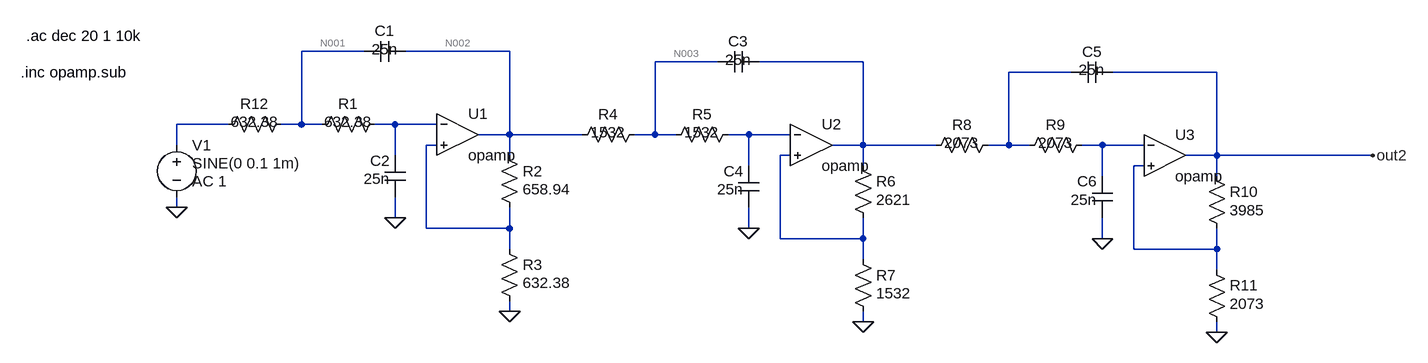
[diagram p0: schematic Draft2.asc]
Draft2.asc, the LTspice schematic file:
Version 4
SHEET 1 1080 680
WIRE -544 -48 -640 -48
WIRE -320 -48 -480 -48
WIRE 0 -32 -96 -32
WIRE 224 -32 64 -32
WIRE 544 -16 448 -16
WIRE 768 -16 608 -16
WIRE -752 64 -832 64
WIRE -640 64 -640 -48
WIRE -640 64 -672 64
WIRE -608 64 -640 64
WIRE -496 64 -528 64
WIRE -432 64 -496 64
WIRE -320 80 -320 -48
WIRE -320 80 -368 80
WIRE -208 80 -320 80
WIRE -96 80 -96 -32
WIRE -96 80 -128 80
WIRE -64 80 -96 80
WIRE 48 80 16 80
WIRE 112 80 48 80
WIRE -832 96 -832 64
WIRE -432 96 -448 96
WIRE 224 96 224 -32
WIRE 224 96 176 96
WIRE 336 96 224 96
WIRE 448 96 448 -16
WIRE 448 96 416 96
WIRE 480 96 448 96
WIRE 592 96 560 96
WIRE 656 96 592 96
WIRE -496 112 -496 64
WIRE -320 112 -320 80
WIRE 112 112 96 112
WIRE 768 112 768 -16
WIRE 768 112 720 112
WIRE 1008 112 768 112
WIRE 48 128 48 80
WIRE 224 128 224 96
WIRE 656 128 640 128
WIRE 592 144 592 96
WIRE 768 144 768 112
WIRE -832 192 -832 176
WIRE -496 208 -496 176
WIRE -448 224 -448 96
WIRE -320 224 -320 192
WIRE -320 224 -448 224
WIRE 48 224 48 192
WIRE 96 240 96 112
WIRE 224 240 224 208
WIRE 224 240 96 240
WIRE 592 240 592 208
WIRE -320 256 -320 224
WIRE 640 256 640 128
WIRE 768 256 768 224
WIRE 768 256 640 256
WIRE 224 272 224 240
WIRE 768 288 768 256
WIRE -320 352 -320 336
WIRE 224 368 224 352
WIRE 768 384 768 368
FLAG -832 192 0
FLAG -496 208 0
FLAG -320 352 0
FLAG 48 224 0
FLAG 224 368 0
FLAG 592 240 0
FLAG 768 384 0
FLAG 1008 112 out2
SYMBOL res -512 48 R90
WINDOW 0 0 56 VBottom 2
WINDOW 3 28 56 VBottom 2
SYMATTR InstName R1
SYMATTR Value 632.38
SYMBOL cap -480 -64 R90
WINDOW 0 0 32 VBottom 2
WINDOW 3 28 32 VBottom 2
SYMATTR InstName C1
SYMATTR Value 25n
SYMBOL cap -480 176 R180
WINDOW 0 24 56 Left 2
WINDOW 3 24 28 Left 2
SYMATTR InstName C2
SYMATTR Value 25n
SYMBOL OpAmps\\opamp -400 16 R0
SYMATTR InstName U1
SYMBOL res -336 96 R0
WINDOW 3 36 68 Left 2
SYMATTR Value 658.94
SYMATTR InstName R2
SYMBOL res -336 240 R0
WINDOW 3 36 68 Left 2
SYMATTR Value 632.38
SYMATTR InstName R3
SYMBOL voltage -832 80 R0
WINDOW 123 24 72 Left 2
WINDOW 39 0 0 Left 0
WINDOW 3 24 44 Left 2
SYMATTR Value2 AC 1
SYMATTR Value SINE(0 0.1 1m)
SYMATTR InstName V1
SYMBOL res -112 64 R90
WINDOW 0 0 56 VBottom 2
WINDOW 3 28 56 VBottom 2
SYMATTR InstName R4
SYMATTR Value 1532
SYMBOL res 32 64 R90
WINDOW 0 0 56 VBottom 2
WINDOW 3 28 56 VBottom 2
SYMATTR InstName R5
SYMATTR Value 1532
SYMBOL cap 64 -48 R90
WINDOW 0 0 32 VBottom 2
WINDOW 3 28 32 VBottom 2
SYMATTR InstName C3
SYMATTR Value 25n
SYMBOL cap 64 192 R180
WINDOW 0 24 56 Left 2
WINDOW 3 24 28 Left 2
SYMATTR InstName C4
SYMATTR Value 25n
SYMBOL res 208 112 R0
WINDOW 3 36 68 Left 2
SYMATTR Value 2621
SYMATTR InstName R6
SYMBOL res 208 256 R0
WINDOW 3 36 68 Left 2
SYMATTR Value 1532
SYMATTR InstName R7
SYMBOL res 432 80 R90
WINDOW 0 0 56 VBottom 2
WINDOW 3 28 56 VBottom 2
SYMATTR InstName R8
SYMATTR Value 2073
SYMBOL res 576 80 R90
WINDOW 0 0 56 VBottom 2
WINDOW 3 28 56 VBottom 2
SYMATTR InstName R9
SYMATTR Value 2073
SYMBOL cap 608 -32 R90
WINDOW 0 0 32 VBottom 2
WINDOW 3 28 32 VBottom 2
SYMATTR InstName C5
SYMATTR Value 25n
SYMBOL cap 608 208 R180
WINDOW 0 24 56 Left 2
WINDOW 3 24 28 Left 2
SYMATTR InstName C6
SYMATTR Value 25n
SYMBOL res 752 128 R0
WINDOW 3 36 68 Left 2
SYMATTR Value 3985
SYMATTR InstName R10
SYMBOL res 752 272 R0
WINDOW 3 36 68 Left 2
SYMATTR Value 2073
SYMATTR InstName R11
SYMBOL res -656 48 R90
WINDOW 0 0 56 VBottom 2
WINDOW 3 28 56 VBottom 2
SYMATTR InstName R12
SYMATTR Value 632.38
SYMBOL OpAmps\\opamp 144 32 R0
SYMATTR InstName U2
SYMBOL OpAmps\\opamp 688 48 R0
SYMATTR InstName U3
TEXT -1072 -16 Left 2 !.inc opamp.sub
TEXT -1064 -72 Left 2 !.ac dec 20 1 10k

The netlist it stands for:
* Draft2.asc
R1 N007 N001 632.38
C1 N002 N001 25n
C2 0 N007 25n
XU1 N007 N009 N002 opamp Aol=100K GBW=10Meg  ; pins invin noninvin out
R2 N002 N009 658.94
R3 N009 0 632.38
V1 N006 0 SINE(0 0.1 1m) AC 1
R4 N003 N002 1532
R5 N008 N003 1532
C3 N004 N003 25n
C4 0 N008 25n
R6 N004 N011 2621
R7 N011 0 1532
R8 N005 N004 2073
R9 N010 N005 2073
C5 out2 N005 25n
C6 0 N010 25n
R10 out2 N012 3985
R11 N012 0 2073
R12 N001 N006 632.38
XU2 N008 N011 N004 opamp Aol=100K GBW=10Meg  ; pins invin noninvin out
XU3 N010 N012 out2 opamp Aol=100K GBW=10Meg  ; pins invin noninvin out
.inc opamp.sub
.ac dec 20 1 10k
.backanno
.end

* Results of the author's LTspice run, read from the files saved beside the schematic
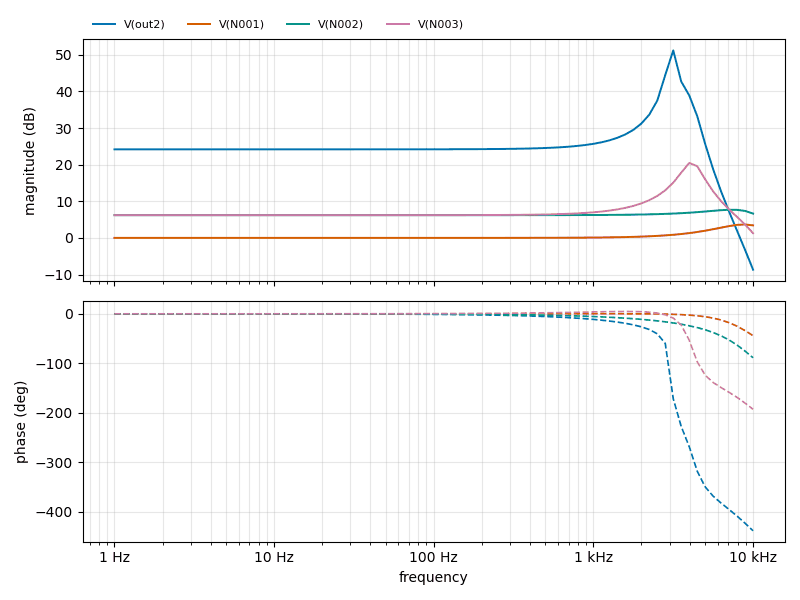
[diagram p1: AC Analysis of Draft2.asc, plotted from the saved traces]
* AC Analysis, 1 run:
*   V(out2): 24.18 dB at 1 Hz, -8.69 dB at 10 kHz, peak 51.19 dB at 3.162 kHz, 3 dB below the peak at 3.004 kHz and 3.294 kHz
*   V(N001): 0.00 dB at 1 Hz, 3.41 dB at 10 kHz, peak 3.66 dB at 8.913 kHz, 3 dB below the peak at 2.752 kHz
*   V(N002): 6.20 dB at 1 Hz, 6.63 dB at 10 kHz, peak 7.68 dB at 7.079 kHz
*   V(N003): 6.20 dB at 1 Hz, 1.28 dB at 10 kHz, peak 20.46 dB at 3.981 kHz, 3 dB below the peak at 3.496 kHz and 4.782 kHz